# EAGLE design gate-detector (EAGLE 7.7.0)
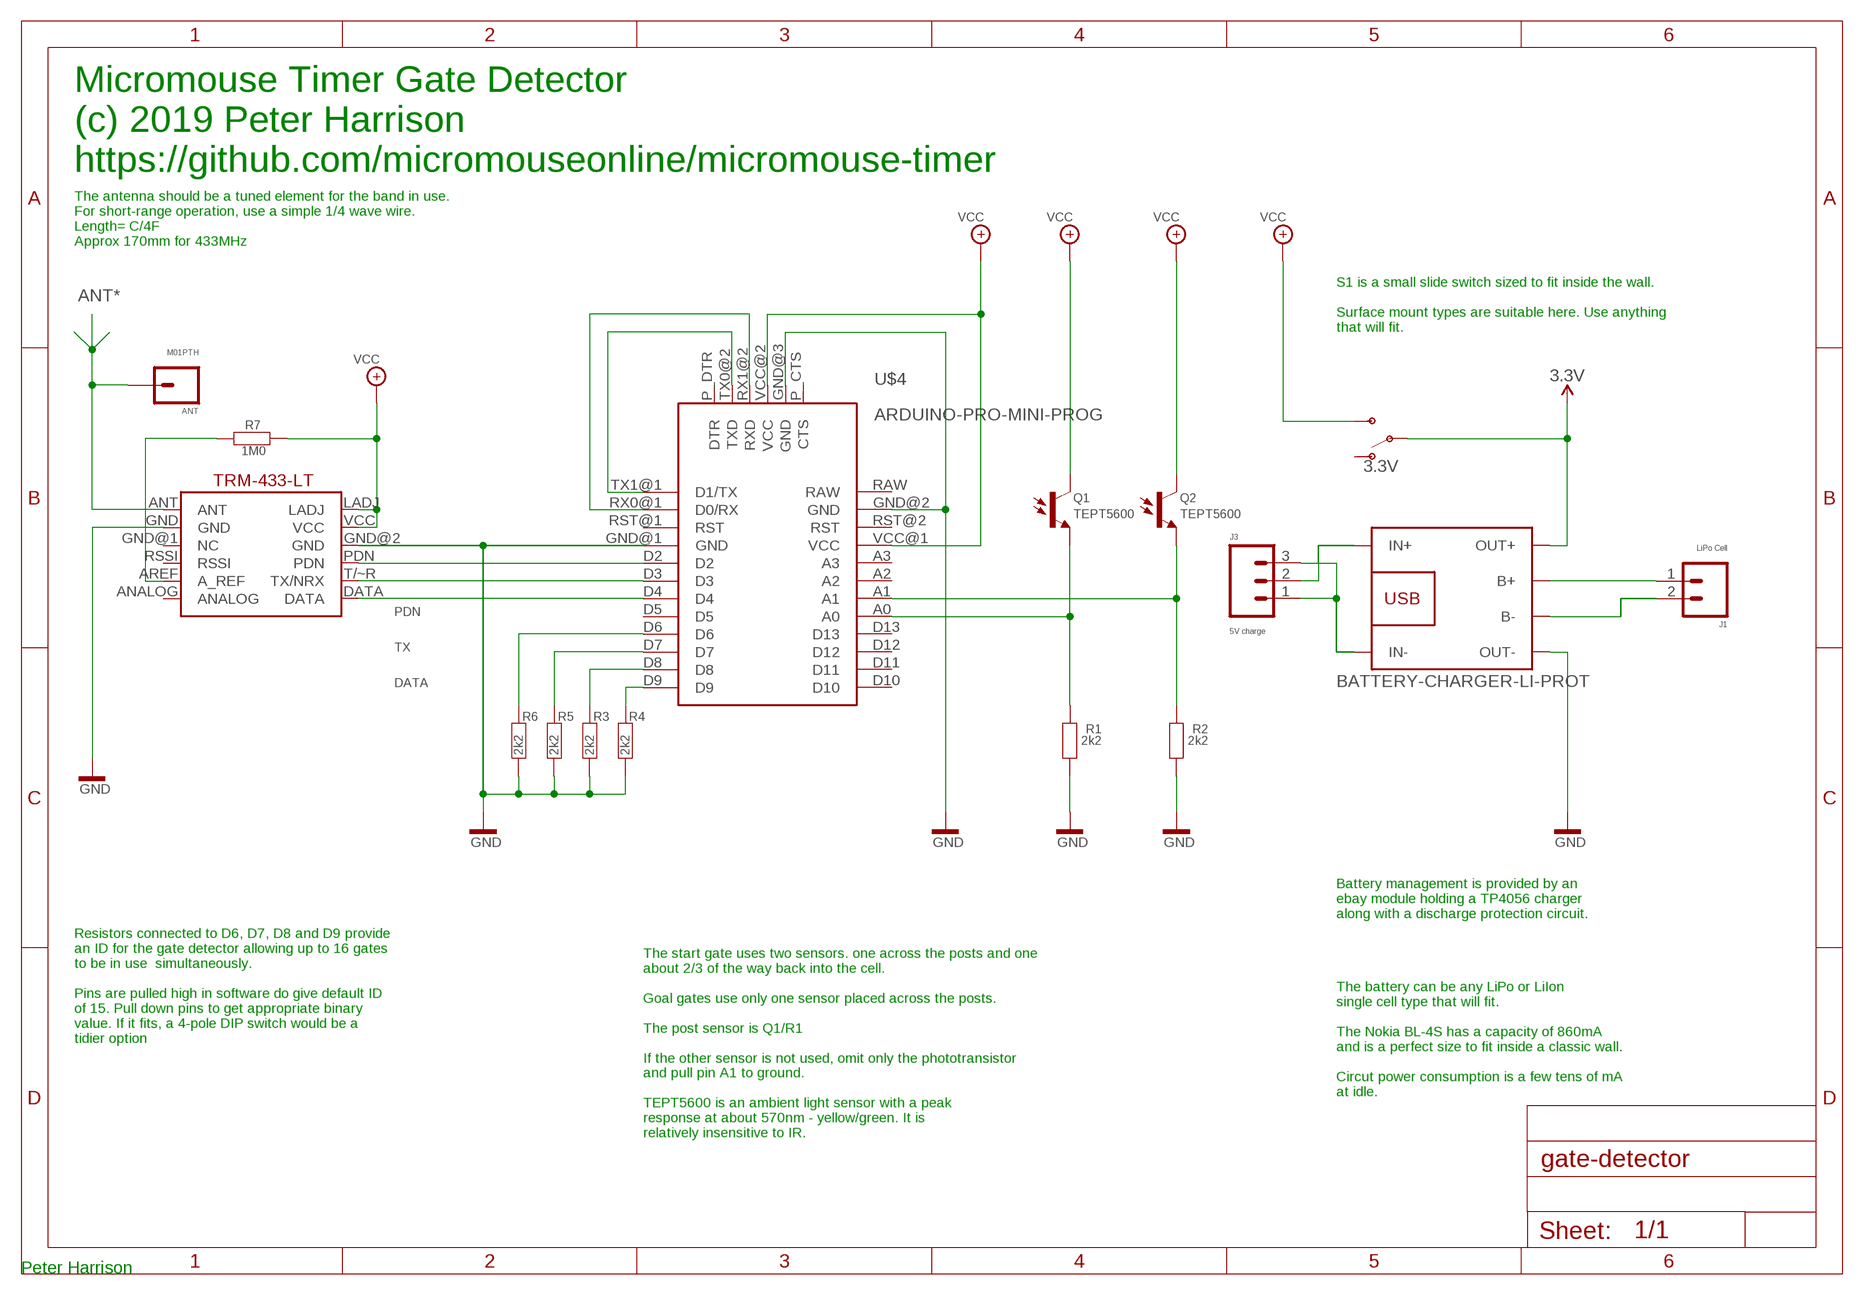
[diagram p0: schematic, sheet 1]
FRAME1 (A4L-LOC): NME: Peter Harrison

## Parts
3.3V  SWITCH-SPDT-PTH-11.6X4.0MM-KIT  [SWITCH_SPDT_PTH_11.6X4.0MM_KIT]
ANT  M01PTH  [1X01]
J1  LiPo Cell  M02RA_MALE_MILL  [1X02_RA_PTH_MALE_MILL]
J3  5V charge  M03RA_MALE  [1X03_RA_PTH_MILL]
Q1  TEPT5600  PHOTO-NPN  [PHOTOTRANSISTOR-TO5-SIDE]
Q2  TEPT5600  PHOTO-NPN  [PHOTOTRANSISTOR-TO5-SIDE]
R1  2k2  RESISTOR_AXIAL-0207_0.4  [AXIAL-0207_0.4]
R2  2k2  RESISTOR_AXIAL-0207_0.4  [AXIAL-0207_0.4]
R3  2k2  RESISTOR_AXIAL-0207_0.4  [AXIAL-0207_0.4]
R4  2k2  RESISTOR_AXIAL-0207_0.4  [AXIAL-0207_0.4]
R5  2k2  RESISTOR_AXIAL-0207_0.4  [AXIAL-0207_0.4]
R6  2k2  RESISTOR_AXIAL-0207_0.4  [AXIAL-0207_0.4]
R7  1M0  RESISTOR_AXIAL-0207_0.4  [AXIAL-0207_0.4]
U$1  TRM-433-LT  [LINX-TRM-433-LT]
U$2  BATTERY-CHARGER-LI-PROT  [BATTERY-CHARGER-LI-PROT]
U$4  ARDUINO-PRO-MINI-PROG  [ARDUINO-PRO-MINI-PROG]

## Nets
3.3V: 3.3V.2(P) U$2.OUT+
ANT*: ANT.1 U$1.ANT
DATA: U$1.DATA U$4.D4
GND: R1.1 R2.1 R3.1 R4.1 R5.1 R6.1 U$1.GND U$1.GND@2(GND) U$2.OUT- U$4.GND@1(GND) U$4.GND@2(GND) U$4.GND@3(GND)
N$1: Q2.E R2.2 U$4.A1
N$2: J1.1 U$2.B+
N$3: R4.2 U$4.D9
N$4: R3.2 U$4.D8
N$5: R5.2 U$4.D7
N$6: Q1.E R1.2 U$4.A0
N$7: J1.2 U$2.B-
N$8: R6.2 U$4.D6
N$9: R7.2 U$1.AREF(A_REF)
N$10: J3.2 U$2.IN+
N$11: J3.1 J3.3 U$2.IN-
N$12: U$4.TX0@2(TXD) U$4.TX1@1(D1/TX)
N$13: U$4.RX0@1(D0/RX) U$4.RX1@2(RXD)
PDN: U$1.PDN U$4.D2
TX: U$1.T/~R(TX/NRX) U$4.D3
VCC: 3.3V.3(S) Q1.C Q2.C R7.1 U$1.LADJ U$1.VCC U$4.VCC@1(VCC) U$4.VCC@2(VCC)
Unconnected: 3.3V.1(O) U$1.ANALOG U$1.GND@1(NC) U$1.RSSI U$4.A2 U$4.A3 U$4.D5 U$4.D10 U$4.D11 U$4.D12 U$4.D13 U$4.P_CTS(CTS) U$4.P_DTR(DTR) U$4.RST@1(RST) U$4.RST@2(RST)

## Notes on the sheet
- Micromouse Timer Gate Detector
  (c) 2019 Peter Harrison
  https://github.com/micromouseonline/micromouse-timer
- The antenna should be a tuned element for the band in use.
  For short-range operation, use a simple 1/4 wave wire.
  Length= C/4F
  Approx 170mm for 433MHz
- S1 is a small slide switch sized to fit inside the wall.
  
  Surface mount types are suitable here. Use anything
  that will fit.
- Battery management is provided by an 
  ebay module holding a TP4056 charger 
  along with a discharge protection circuit.
- Resistors connected to D6, D7, D8 and D9 provide 
  an ID for the gate detector allowing up to 16 gates 
  to be in use  simultaneously.
  
  Pins are pulled high in software do give default ID
  of 15. Pull down pins to get appropriate binary 
  value. If it fits, a 4-pole DIP switch would be a 
  tidier option
- The battery can be any LiPo or LiIon 
  single cell type that will fit.
  
  The Nokia BL-4S has a capacity of 860mA
  and is a perfect size to fit inside a classic wall.
  
  Circut power consumption is a few tens of mA 
  at idle.
- The start gate uses two sensors. one across the posts and one
  about 2/3 of the way back into the cell.
  
  Goal gates use only one sensor placed across the posts.
  
  The post sensor is Q1/R1
  
  If the other sensor is not used, omit only the phototransistor
  and pull pin A1 to ground.
  
  TEPT5600 is an ambient light sensor with a peak 
  response at about 570nm - yellow/green. It is 
  relatively insensitive to IR.

## Power pins joined to a net without a drawn wire
RAW: U$4.RAW

## Library data of the parts
3.3V = micromouse-timer:SWITCH-SPDT: Single Pole, Double Throw (SPDT) Switch Single-pole, double-throw (SPDT) switch. Variant Overview SMD-AYZ0202 Surface Mount DPDT Switch <https://www.sparkfun.com/products/597> (COM-00597) Used on e.g. LilyPad Arduino USB - ATmega32U4 Board <https://www.sparkfun.com/products/12049> PTH-11.6X4.0MM SPDT Mini Power Switch <https://www.sparkfun.com/products/102> (COM-00102) Used on e.g. SparkFun Simon Says - Through-Hole Soldering Kit <https://www.sparkfun.com/products/10547> (KIT-10547) PTH-11.6X4.0MM-KIT KIT version of SPDT Mini Power Switch - Simplifies soldering by removing tStop of switch pins - only one side can be soldered. PTH-11.6X4.0MM-LOCK LOCK version of SPDT Mini Power Switch - Offset pins hold switch in place for easier soldering. SMD-RIGHT-ANGLE Surface Mount Right Angle Switch <https://www.sparkfun.com/products/10860> (COM-10860) Used on e.g. SparkFun ESP8266 Thing <https://www.sparkfun.com/products/13231>; PROD_ID: SWCH-08261; SF_SKU: COM-00102
ANT = micromouse-timer:M01: Header 1 Standard 1-pin 0.1" header. Use with straight break away headers (SKU : PRT-00116), right angle break away headers (PRT-00553), swiss pins (PRT-00743), machine pins (PRT-00117), and female headers (PRT-00115).
J1 = micromouse-timer:M02: 2 pin header/connector
J3 = micromouse-timer:M03: Header 3 Standard 3-pin 0.1" header. Use with straight break away headers (SKU : PRT-00116), right angle break away headers (PRT-00553), swiss pins (PRT-00743), machine pins (PRT-00117), and female headers (PRT-00115). Molex polarized connector foot print use with SKU : PRT-08232 with associated crimp pins and housings.
Q1 Q2 = micromouse-timer:PHOTO-NPN
R1-R7 = micromouse-timer:RESISTOR_: Resistor Basic schematic elements and footprints for 0603, 1206, and PTH 1/10th watt (small) resistors.
U$1 = micromouse-timer:TRM-433-LT: LINX 433 MHz Tranceiver
U$2 = micromouse-timer:BATTERY-CHARGER-LI-PROT: Lithium Battery 5V Charger with protection circuit More details available here: http://www.instructables.com/id/DIY-Lithium-ion-Battery-Charger/step4/TP4056-based-lithium-ion-battery-charger-module/ Click here to find device on ebay.com <http://www.ebay.com/sch/tp4056+charger+usb+protection>
U$4 = micromouse-timer:ARDUINO-PRO-MINI-PROG

## Board
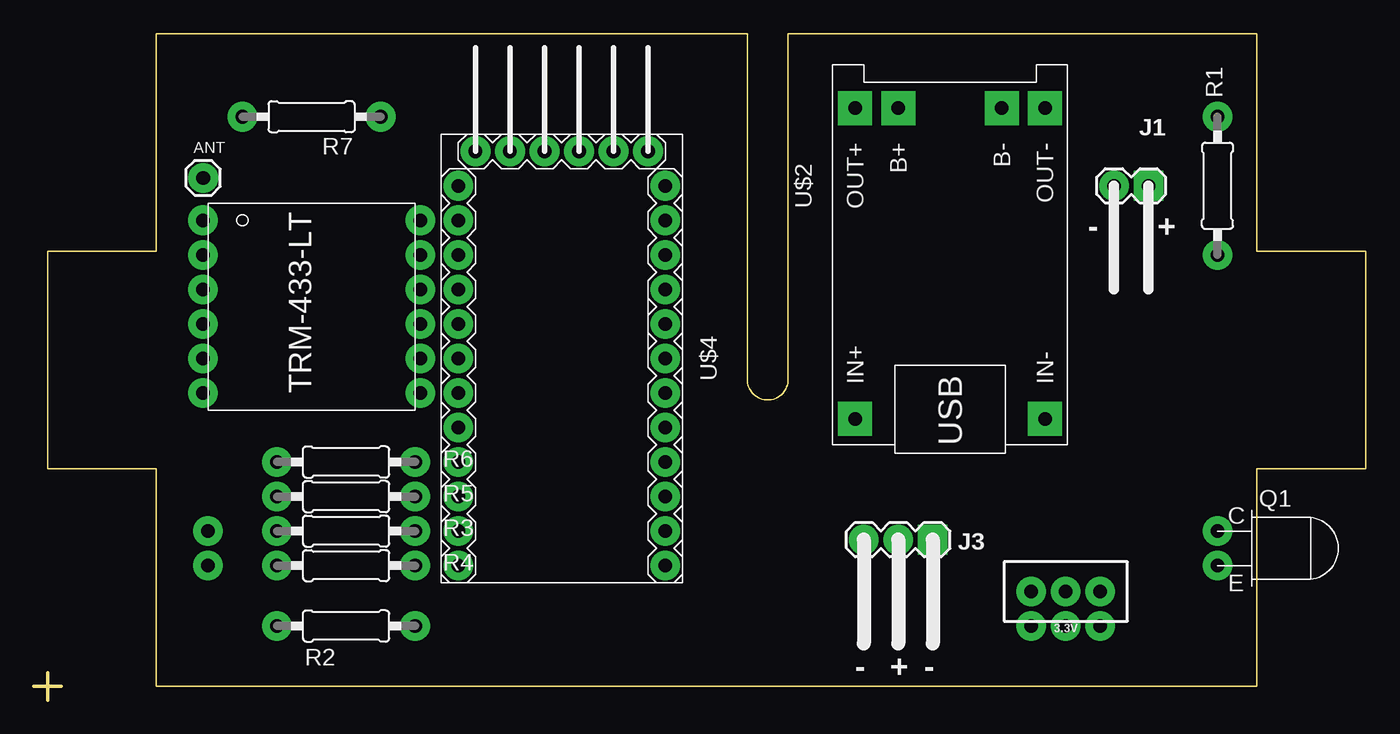
[diagram p1: board, top side]
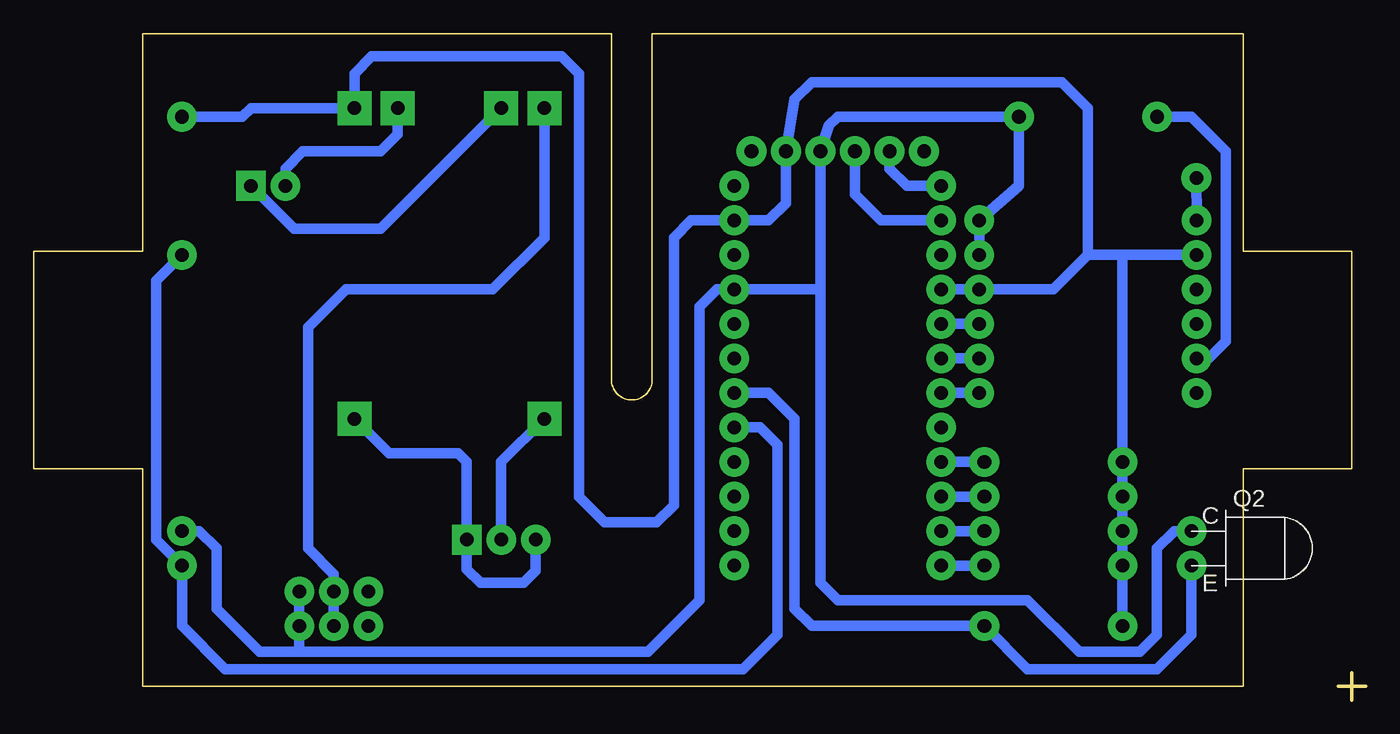
[diagram p2: board, bottom side, seen from below]

Size 98 x 49 mm. Coordinates in mm from the lower left corner, seen from the top.
Outline: 55,1 9,1 9,17 1,17 1,33 9,33 9,49 52.5,49 52.5,23.58 arc90 54,22.08 arc90 55.5,23.58 55.5,49 90,49 90,33 98,33 98,17 90,17 90,1
Outline: 89.98,1 55.01,1
Outline: 0,1 2,1
Outline: 1,2 1,0
Copper layers (1*16): Top 0.035mm / dielectric 1.5mm / Bottom 0.035mm
Design rules "gate-controller-eagle7-V2": minimum track width 30mil, minimum drill 0.8mm, track to track 0.205mm, track to pad 0.205mm, pad to pad 0.205mm, via to via 0.205mm, smd to smd 0mil, copper to edge 0.25mm, drill to drill 6mil, minimum pad ring 10mil, minimum via ring 10mil, stop-mask expansion 1mil, vias tented up to drill 30mil, thermal gap 6mil

### Footprints (pad centres in the part's own frame; a part is rotated, then mirrored left to right if it is on the bottom)
SWITCH_SPDT_PTH_11.6X4.0MM_KIT = drill 1 pad 2.184: 1 0,2.54; 2 0,0; 3 0,-2.54
1X01 = drill 1 pad 2.184: 1 0,0
1X02_RA_PTH_MALE_MILL = drill 1 pad 2.184 square: 1 0,0 | drill 1 pad 2.184: 2 2.54,0
1X03_RA_PTH_MILL = drill 1 pad 2.184 square: 1 0,0 | drill 1 pad 2.184: 2 2.54,0; 3 5.08,0
PHOTOTRANSISTOR-TO5-SIDE = drill 1 pad 2.184: C 0,1.27; E 0,-1.27
AXIAL-0207_0.4 = drill 1 pad 2.184: 1 -5.08,0; 2 5.08,0
LINX-TRM-433-LT = drill 1 pad 2.184: ANALOG -8,-5.08; ANT -8,7.62; AREF -8,-2.54; DATA 8,-5.08; GND -8,5.08; GND@1 -8,2.54; GND@2 8,2.54; LADJ 8,7.62; PDN 8,0; RSSI -8,0; T/~R 8,-2.54; VCC 8,5.08
BATTERY-CHARGER-LI-PROT = drill 1 pad 2.5 square: B+ 10.795,3.81; B- 10.795,-3.81; IN+ -12.065,6.985; IN- -12.065,-6.985; OUT+ 10.795,6.985; OUT- 10.795,-6.985
ARDUINO-PRO-MINI-PROG = drill 1 pad 2.184: A0 8.89,7.62; A1 6.35,7.62; A2 3.81,7.62; A3 1.27,7.62; D2 1.27,-7.62; D3 3.81,-7.62; D4 6.35,-7.62; D5 8.89,-7.62; D6 11.43,-7.62; D7 13.97,-7.62; D8 16.51,-7.62; D9 19.05,-7.62; D10 19.05,7.62; D11 16.51,7.62; D12 13.97,7.62; D13 11.43,7.62; GND@1 -6.35,7.62; GND@2 -1.27,-7.62; GND@3 -11.43,3.81; P_CTS -11.43,6.35; P_DTR -11.43,-6.35; RAW -8.89,7.62; RST@1 -3.81,7.62; RST@2 -3.81,-7.62; RX0@1 -6.35,-7.62; RX1@2 -11.43,-1.27; TX0@2 -11.43,-3.81; TX1@1 -8.89,-7.62; VCC@1 -1.27,7.62; VCC@2 -11.43,1.27

### Placement (x,y rotation side)
3.3V  75.93,7.99 90 top
ANT  12.45,38.41 0 top
J1  82.03,37.83 180 top
J3  66.15,11.79 180 top
Q1  87.11,11.16 0 top
Q2  12.81,11.16 0 bottom
R1  87.11,37.83 270 top
R2  22.97,5.45 0 top
R3  22.97,12.43 0 top
R4  22.97,9.89 0 top
R5  22.97,14.97 0 top
R6  22.97,17.51 0 top
R7  20.43,42.91 180 top
U$1  20.43,27.67 0 top
U$2  67.42,32.75 90 top
U$4  38.84,28.94 270 top

### Tracks (layer width: path | path; a pad name or v marks a point on that pad's centre or on a via)
3.3V
  Bottom 0.762: U$2.OUT+ 60.44,34.02 64.25,30.21 75.04,30.21 77.39,27.86 77.58,27.67 77.83,27.41 77.83,11.16 75.93,9.26 3.3V.2 75.93,5.45
ANT*
  Bottom 0.762: U$1.ANT 12.41,35.41 ANT.1
DATA
  Bottom 0.762: U$4.D4 U$1.DATA
GND
  Bottom 0.762: 20.43,32.75 17.89,32.75 | 17.89,32.75 U$1.GND | 17.89,32.75 R6.1 R5.1 R3.1 R4.1 R2.1 | 20.43,32.75 22.97,30.21 U$1.GND@2 U$4.GND@2 | 87.3,42.91 R1.1 82.66,42.91 82.03,43.55 U$2.OUT- 74.41,46.09 73.14,47.35 59.16,47.35 57.9,46.09 57.9,14.97 55.99,13.06 52.18,13.06 50.91,14.34 50.91,34.02 49.64,35.29 U$4.GND@1 43.92,35.29 42.66,36.56 U$4.GND@3 42.02,44.18 40.75,45.45 22.34,45.45 20.43,43.55 20.43,32.75
N$1
  Bottom 0.762: Q2.E 12.81,4.81 15.35,2.27 24.88,2.27 R2.2 40.75,5.45 42.02,6.71 42.02,20.68 43.92,22.59 U$4.A1
N$2
  Bottom 0.762: U$2.B+ 72.5,34.66 78.85,34.66 J1.1
N$3
  Bottom 0.762: R4.2 U$4.D9
N$4
  Bottom 0.762: R3.2 U$4.D8
N$5
  Bottom 0.762: R5.2 U$4.D7
N$6
  Bottom 0.762: R1.2 89.01,30.84 89.01,11.79 Q1.E 87.11,5.45 83.93,2.27 45.83,2.27 43.29,4.81 43.29,18.78 44.56,20.05 U$4.A0
N$7
  Bottom 0.762: U$2.B- 71.23,41.64 72.5,40.37 78.22,40.37 79.48,39.1 J1.2
N$8
  Bottom 0.762: R6.2 U$4.D6
N$9
  Bottom 0.762: U$1.AREF 11.54,25.13 10.27,26.4 10.27,40.37 12.81,42.91 R7.2
N$10
  Bottom 0.762: J3.2 63.61,17.51 U$2.IN+
N$11
  Bottom 0.762: U$2.IN- 71.86,18.14 66.78,18.14 66.15,17.51 J3.1 66.15,9.63 65.14,8.62 61.96,8.62 61.07,9.51 J3.3
N$12
  Bottom 0.762: U$4.TX1@1 33.77,37.83 35.03,39.1 U$4.TX0@2
N$13
  Bottom 0.762: U$4.RX0@1 35.67,35.29 37.58,37.2 U$4.RX1@2
N$14  (via drill 1 pad 2.18)
  other vias: 75.93,5.45
N$16  (via drill 1 pad 2.18)
  other vias: 73.39,5.45
PDN
  Bottom 0.762: U$4.D2 U$1.PDN
TX
  Bottom 0.762: U$4.D3 U$1.T/~R
VCC  (via drill 1 pad 2.18)
  Bottom 0.762: U$1.VCC U$1.LADJ 25.51,37.83 R7.1 38.84,42.91 39.48,42.27 U$4.VCC@2 40.12,30.21 | 40.12,30.21 U$4.VCC@1 47.73,30.21 49.01,28.94 49.01,7.35 52.81,3.54 78.47,3.54 | Q1.C 85.83,12.43 84.56,11.16 84.56,6.71 81.39,3.54 78.47,3.54 | Q2.C 14.08,12.43 15.35,11.16 15.35,4.81 16.62,3.54 21.07,3.54 24.88,7.35 38.84,7.35 40.12,8.62 40.12,30.21 | 3.3V.3 v78.47,5.45 78.47,3.54

### Text on the board
tPlace: - | + | - | + | -